# Altium schematic sheet Battery Charger.SchDoc
size 209 x 297 mm; Author: Мурашкин Д.В.; Address1: Address1; Address2: Address2; Address3: Address3; Address4: Address4; DocumentNumber: SS19946-01; Scale: 1:1; Letter1Column: Э; PartName: Блок питания
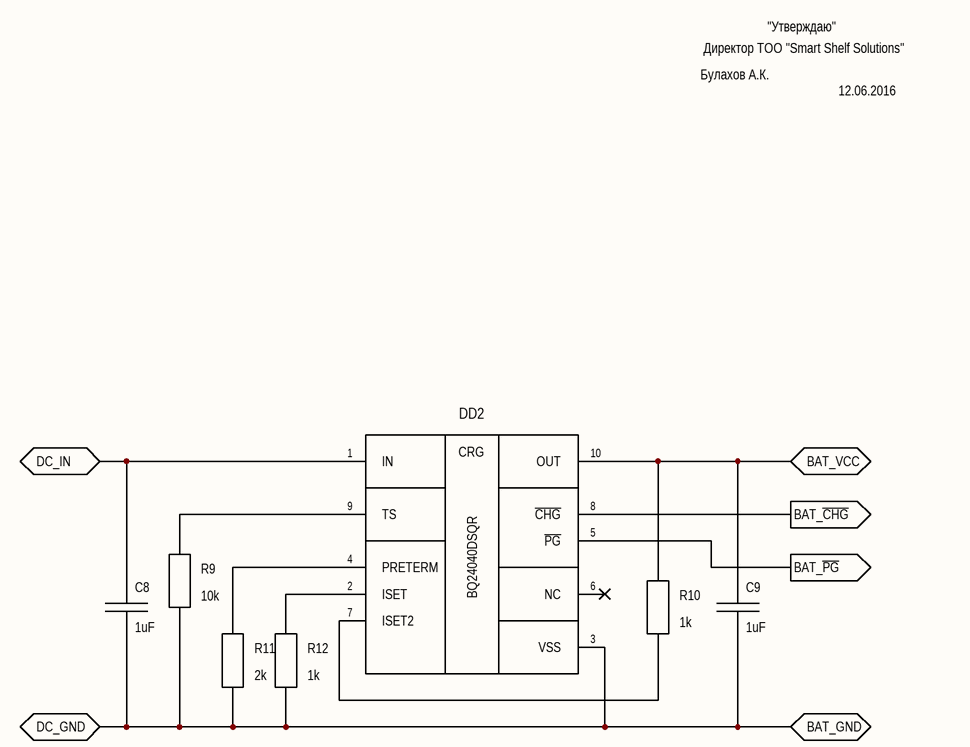
[diagram p0: Battery Charger.SchDoc]

## Parts
C8  1uF  [CAPC1608L]
C9  1uF  [CAPC1608L]
DD2  BQ24040DSQR  [WFDFN-10]
R9  10k  [RESC1608L]
R10  1k  [RESC1608L]
R11  2k  [RESC1608L]
R12  1k  [RESC1608L]

## Ports
BAT_GND, BAT_VCC, BAT_~{CHG} (out), BAT_~{PG} (out), DC_GND, DC_IN

## Nets
BAT_~{CHG}: DD2.8(~{CHG}) ; port BAT_~{CHG}
BAT_GND: C8.2 C9.2 DD2.3(VSS) R9.2 R11.2 R12.2 ; port DC_GND, port BAT_GND
BAT_~{PG}: DD2.5(~{PG}) ; port BAT_~{PG}
BAT_VCC: C9.1 DD2.10(OUT) R10.1 ; port BAT_VCC
DC_IN: C8.1 DD2.1(IN) ; port DC_IN
NetDD2_2: DD2.2(ISET) R12.1
NetDD2_4: DD2.4(PRETERM) R11.1
NetDD2_7: DD2.7(ISET2) R10.2
NetDD2_9: DD2.9(TS) R9.1

Not connected (* = marked no-connect by the designer): DD2 6(NC)*

## Notes on the sheet
- Булахов А.К.
- "Утверждаю"
- Директор ТОО "Smart Shelf Solutions"
- 12.06.2016
- Перв. примен.
- Справ. №
- Подп. и дата
- Инв. № дубл.
- Взам. инв. №
- Разраб.
- Изм.
- Лист
- № докум.
- Подп.
- Дата
- Лит.
- Масса
- Масштаб
- Пров.
- Т.контр.
- Листов
- Инв. № подл.
- Утв.
- Н.контр.
- 2.106-A4
- Копировал
- Формат А4
- (in symbol BQ24040DSQR) CRG

## Library data of the parts
C8 C9 = CC0603KRX5R8BB105: Capacitor Ceramic 1uF 25V; Manufacturer: Yageo; Group: Ceramic Capacitors; Temperature Coefficient: X5R; Tolerance: ±10%; Short description: CAP CER 1UF 25V X5R 0603; Type: Ceramic; Part name: CC0603KRX5R8BB105; Voltage: 25V; Package: 1608; Value: 1uF
DD2 = BQ24040DSQR: Battery Charger Li-ion/Li Polymer; Manufacturer: Texas Instruments; Group: PMIC - Battery Chargers; Short description: IC BATT CHG LI-ION 1 CELL 10SON; Package: WFDFN-10; Part name: BQ24040DSQR
R9 = RC0603JR-0710KL: Resistor Ceramic 10k 1608; Manufacturer: Yageo; Group: Resistors; Temperature Coefficient: ±100ppm/°C; Tolerance: ±5%; Voltage: 75 V; Power: 0.1W; Short description: RES SMD 10K OHM 5% 1/10W 0603; Part name: RC0603JR-0710KL; Type: Thin Film; Package: 1608; Value: 10k
R10 R12 = RC0603JR-071KL: Resistor Ceramic 1k 1608; Manufacturer: Yageo; Group: Resistors; Temperature Coefficient: ±100ppm/°C; Tolerance: ±5%; Power: 0.1W; Short description: RES SMD 1K OHM 5% 1/10W 0603; Part name: RC0603JR-071KL; Type: Thin Film; Package: 1608; Value: 1k
R11 = RC0603JR-072KL: Resistor Ceramic 2k 1608; Manufacturer: Yageo; Group: Resistors; Temperature Coefficient: ±100ppm/°C; Tolerance: ±5%; Power: 0.1W; Short description: RES SMD 2K OHM 5% 1/10W 0603; Part name: RC0603JR-072KL; Type: Thin Film; Package: 1608; Value: 2k